# Altium schematic sheet Power.SchDoc
size A4; SheetNumber: 5; SheetTotal: 6
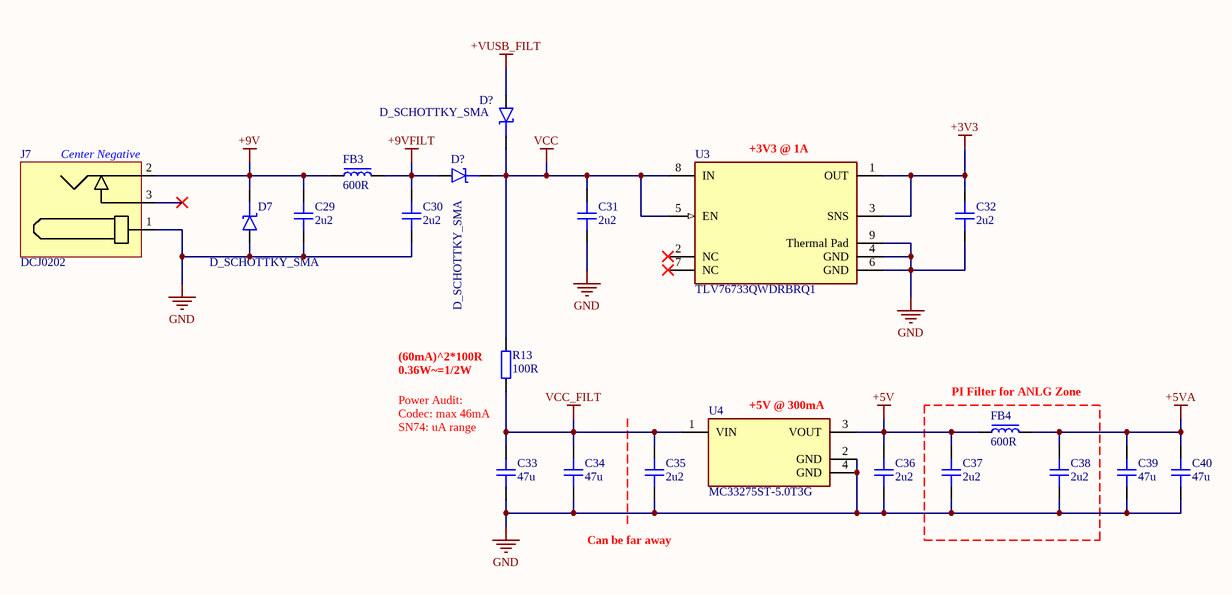
[diagram p0: Power.SchDoc]

## Parts
(Parts that share a designator on the sheet are numbered #1, #2 ... from top to bottom, then left to right.)
C29  2u2  [CAP_0603]
C30  2u2  [CAP_0603]
C31  2u2  [CAP_0603]
C32  2u2  [CAP_0603]
C33  47u  [CAP_0805]
C34  47u  [CAP_0805]
C35  2u2  [CAP_0603]
C36  2u2  [CAP_0603]
C37  2u2  [CAP_0603]
C38  2u2  [CAP_0603]
C39  47u  [CAP_0805]
C40  47u  [CAP_0805]
D7  D_SCHOTTKY_SMA  [DO-214AC-2 (SMA)]
D?#1  D_SCHOTTKY_SMA  [DO-214AC-2 (SMA)]
D?#2  D_SCHOTTKY_SMA  [DO-214AC-2 (SMA)]
FB3  600R  [FB_0603]
FB4  600R  [FB_0603]
J7  DCJ0202  [DCJ0202]
R13  100R  [RES_0805]
U3  TLV76733QWDRBRQ1  [FP-DRB0008J-IPC_C]
U4  MC33275ST-5.0T3G  [FP-318E-04-IPC_A]

## Blocks framed on the sheet
PI Filter for ANLG Zone: C37 C38 FB4

## Nets
+3V3: C32.2 U3.1(OUT) U3.3(SNS)
+5V: C36.2 C37.2 FB4.1 U4.3(VOUT)
+5VA: C38.2 C39.2 C40.2 FB4.2
+9V: C29.2 D7.K FB3.1 J7.2
+9VFILT: C30.2 D?#2.A FB3.2
+VUSB_FILT: D?#1.A
GND: C29.1 C30.1 C31.1 C32.1 C33.1 C34.1 C35.1 C36.1 C37.1 C38.1 C39.1 C40.1 D7.A J7.1 U3.4(GND) U3.6(GND) U3.9(Thermal_Pad) U4.2(GND) U4.4(GND)
VCC: C31.2 D?#1.K D?#2.K R13.2 U3.5(EN) U3.8(IN)
VCC_FILT: C33.2 C34.2 C35.2 R13.1 U4.1(VIN)

Not connected (* = marked no-connect by the designer): J7 3*; U3 2(NC)* 7(NC)*

## Notes on the sheet
- (near U3) +3V3 @ 1A
- (near J7) Center Negative
- (near R13) (60mA)^2*100R
- (near R13) 0.36W~=1/2W
- (near U4) +5V @ 300mA
- Power Audit:
  Codec: max 46mA
  SN74: uA range
- Can be far away

## Library data of the parts
C29-C32 C35-C38 = CAP_0603: Capacitor SMD 0603; Manufacturer: *; Manufacturer Part Number: *; Distributor Link: *; LCSC: *; Rating: *; Dielectric: *
C33 C34 C39 C40 = CAP_0805: Capacitor SMD 0805; Manufacturer: *; Manufacturer Part Number: *; Distributor Link: *; LCSC: *; Rating: *; Dielectric: *
D7 D?#1 D?#2 = D_SCHOTTKY_SMA: Diode Schottky SMD SMA (DO-214AA)
FB3 FB4 = FB_0603: Ferrite Bead SMD 0603; Manufacturer: *; Manufacturer Part Number: *; Distributor Link: *; LCSC: *
J7 = DCJ0202: DC Barrell Jack 2.1mm 24V 5A THT; Manufacturer: CONEC; Manufacturer Part Number: DCJ0202
R13 = RES_0805: Resistor SMD 0805; Manufacturer: *; Manufacturer Part Number: *; Distributor Link: *; LCSC: *
U3 = CMP-04917-000370-1: IC OPAMP; RoHS Compliant: Yes
U4 = CMP-07128-000032-1: IC REG LINEAR 5V 300MA SOT223; Accuracy: 1%; Number of Outputs: 1; Quiescent Current: 2mA; Input Bias Current: 1.5mA; Dropout Voltage: 260mV; Min Input Voltage: 6V; Output Type: Fixed; Max Input Voltage: 13V; Polarity: Positive; Radiation Hardening: No; Mount: Surface Mount; Output Current: 300mA; REACH SVHC: No SVHC; Contact Plating: Tin; Max Output Current: 300mA; Output Voltage: 5V; Number of Pins: 3; Width: 6.7mm; Min Output Voltage: 5V; Height: 1.65mm; Min Operating Temperature: -40°C; Package Quantity: 1; Lead Free: Lead Free; Case/Package: SOT-223; Max Operating Temperature: 125°C; Number of Regulators: 1; Current Rating: 300mA; Nominal Output Voltage: 5V; Output Voltage Accuracy: 1%; Length: 6.7mm; Packaging: Tape and Reel; Halogen Free: Halogen Free